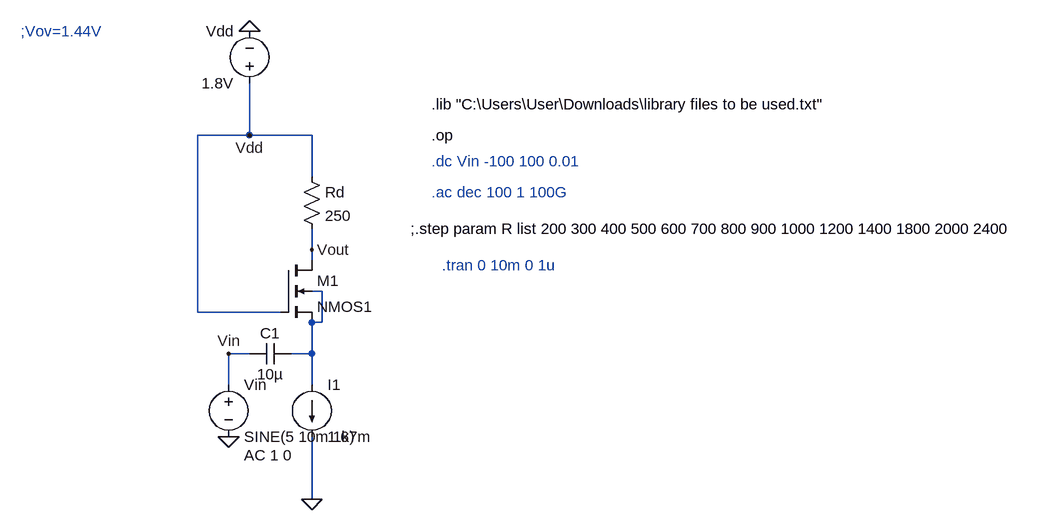
[diagram p0: schematic Q2.asc]
Q2.asc, the LTspice schematic file:
Version 4.1
SHEET 1 1420 680
WIRE 112 -144 112 -224
WIRE 112 -144 32 -144
WIRE 208 -144 112 -144
WIRE 208 -80 208 -144
WIRE 208 32 208 0
WIRE 208 48 208 32
WIRE 224 96 208 96
WIRE 32 128 32 -144
WIRE 160 128 32 128
WIRE 224 144 224 96
WIRE 224 144 208 144
WIRE 112 192 80 192
WIRE 208 192 208 144
WIRE 208 192 176 192
WIRE 80 240 80 192
WIRE 208 240 208 192
WIRE 208 416 208 320
FLAG 208 416 0
FLAG 112 -304 0
FLAG 80 320 0
FLAG 208 32 Vout
FLAG 112 -144 Vdd
FLAG 80 192 Vin
SYMBOL res 192 -96 R0
SYMATTR InstName Rd
SYMATTR Value 250
SYMBOL voltage 112 -208 R180
WINDOW 0 24 96 Left 2
WINDOW 3 24 16 Left 2
SYMATTR InstName Vdd
SYMATTR Value 1.8V
SYMBOL voltage 80 224 R0
WINDOW 123 24 124 Left 2
WINDOW 39 0 0 Left 0
SYMATTR InstName Vin
SYMATTR Value SINE(5 10m 1k)
SYMATTR Value2 AC 1 0
SYMBOL nmos4 160 48 R0
SYMATTR InstName M1
SYMATTR Value NMOS1
SYMATTR Value2 l=284.434n w=2000n
SYMBOL current 208 240 R0
WINDOW 123 0 0 Left 0
WINDOW 39 0 0 Left 0
SYMATTR InstName I1
SYMATTR Value 1.67m
SYMBOL cap 176 176 R90
WINDOW 0 0 32 VBottom 2
WINDOW 3 32 32 VTop 2
SYMATTR InstName C1
SYMATTR Value 10µ
TEXT 392 -144 Left 2 !.op
TEXT 392 -104 Left 2 ;.dc Vin -100 100 0.01
TEXT 392 -56 Left 2 ;.ac dec 100 1 100G
TEXT 392 -192 Left 2 !.lib "C:\\Users\\User\\Downloads\\library files to be used.txt"
TEXT 360 0 Left 2 !;.step param R list 200 300 400 500 600 700 800 900 1000 1200 1400 1800 2000 2400
TEXT 408 56 Left 2 ;.tran 0 10m 0 1u
TEXT -240 -304 Left 2 ;;Vov=1.44V

The netlist it stands for:
* Q2.asc
Rd Vdd Vout 250
Vdd Vdd 0 1.8V
Vin Vin 0 SINE(5 10m 1k) AC 1 0
M1 Vout Vdd N001 N001 NMOS1 l=284.434n w=2000n
I1 N001 0 1.67m
C1 N001 Vin 10µ
.model NMOS NMOS
.model PMOS PMOS
.lib standard.mos
.op
* .dc Vin -100 100 0.01
* .ac dec 100 1 100G
.lib "C:\Users\User\Downloads\library files to be used.txt"
;.step param R list 200 300 400 500 600 700 800 900 1000 1200 1400 1800 2000 2400
* .tran 0 10m 0 1u
* ;Vov=1.44V
.backanno
.end